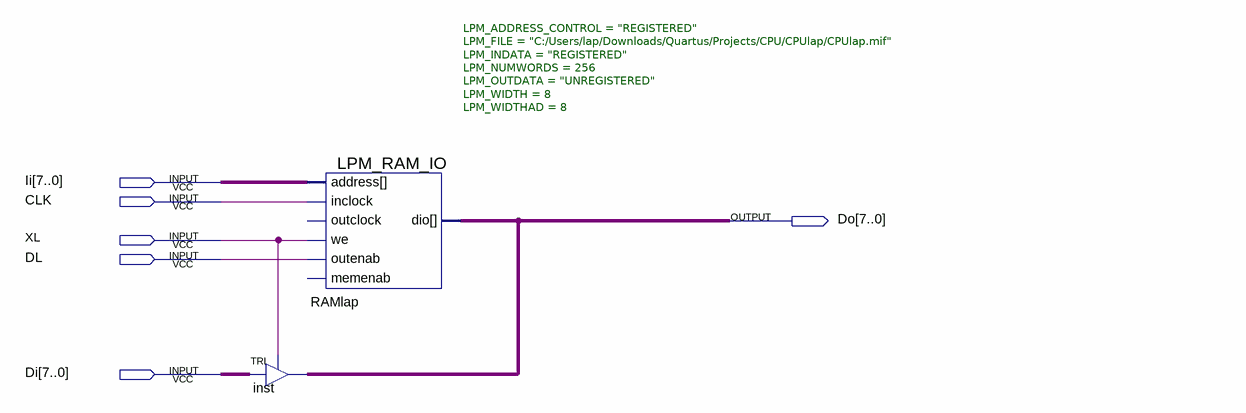
[diagram p0: schematic sheet]
// Quartus schematic RAMlap.bdf as structural Verilog: 2 symbols, 6 pins
module RAMlap (
  input  [7:0] Ii,
  input  CLK,
  input  XL,
  input  DL,
  input  [7:0] Di,
  output [7:0] Do
);

  TRI inst[7:0] (.IN(Di), .OE(XL), .OUT(Do));
  LPM_RAM_IO #(.LPM_ADDRESS_CONTROL("REGISTERED"), .LPM_FILE("C:/Users/lap/Downloads/Quartus/Projects/CPU/CPUlap/CPUlap.mif"), .LPM_INDATA("REGISTERED"), .LPM_NUMWORDS(256), .LPM_OUTDATA("UNREGISTERED"), .LPM_WIDTH(8), .LPM_WIDTHAD(8)) RAMlap (
    .address(Ii), .inclock(CLK), .we(XL), .outenab(DL), .dio(Do));  // open: outclock, memenab
endmodule
